# EAGLE design Tutorial1 (EAGLE 7.3.0)
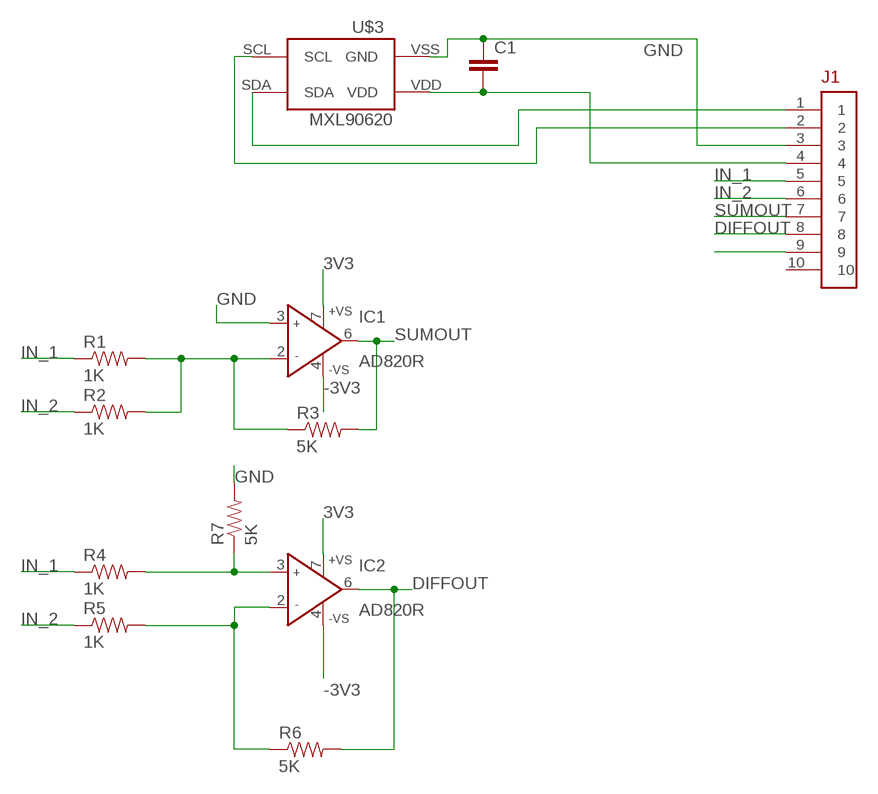
[diagram p0: schematic, sheet 1]

## Parts
C1  CAP0805  [0805]
IC1  AD820R  [SO8]
IC2  AD820R  [SO8]
J1  M50-3120545  [10PINFEMALE]
R1  1K  RESISTOR  [0805]
R2  1K  RESISTOR  [0805]
R3  5K  RESISTOR  [0805]
R4  1K  RESISTOR  [0805]
R5  1K  RESISTOR  [0805]
R6  5K  RESISTOR  [0805]
R7  5K  RESISTOR  [0805]
U$3  MXL90620  [MXL90620]

## Nets
3V3: C1.2 IC1.7(+VS) IC2.7(+VS) J1.4 U$3.VDD
-3V3: IC1.4(-VS) IC2.4(-VS) J1.9
DIFFOUT: IC2.6(OUT) J1.8 R6.2
GND: C1.1 IC1.3(IN+) J1.3 R7.2 U$3.VSS(GND)
IN_1: J1.5 R1.1 R4.1
IN_2: J1.6 R2.1 R5.1
N$1: IC1.2(IN-) R1.2 R2.2 R3.1
N$3: J1.1 U$3.SDA
N$4: J1.2 U$3.SCL
N$5: IC2.2(IN-) R5.2 R6.1
N$6: IC2.3(IN+) R4.2 R7.1
SUMOUT: IC1.6(OUT) J1.7 R3.2
Unconnected: J1.10

## Library data of the parts
C1 = CNTRL_BOARD:CAP: Capacitor Standard 0603 ceramic capacitor, and 0.1" leaded capacitor.
IC1 IC2 = analog-devices:AD820: Single-Supply, Rail-to-Rail, Low Power, FET Input Op Amp Source: http://www.analog.com/static/imported-files/data_sheets/AD820.pdf; OC_FARNELL: 1838867; OC_NEWARK: unknown
J1 = LED_Driver_Board:M50-3120545
R1-R7 = CNTRL_BOARD:RESISTOR
U$3 = CNTRL_BOARD:MXL90620

## Board
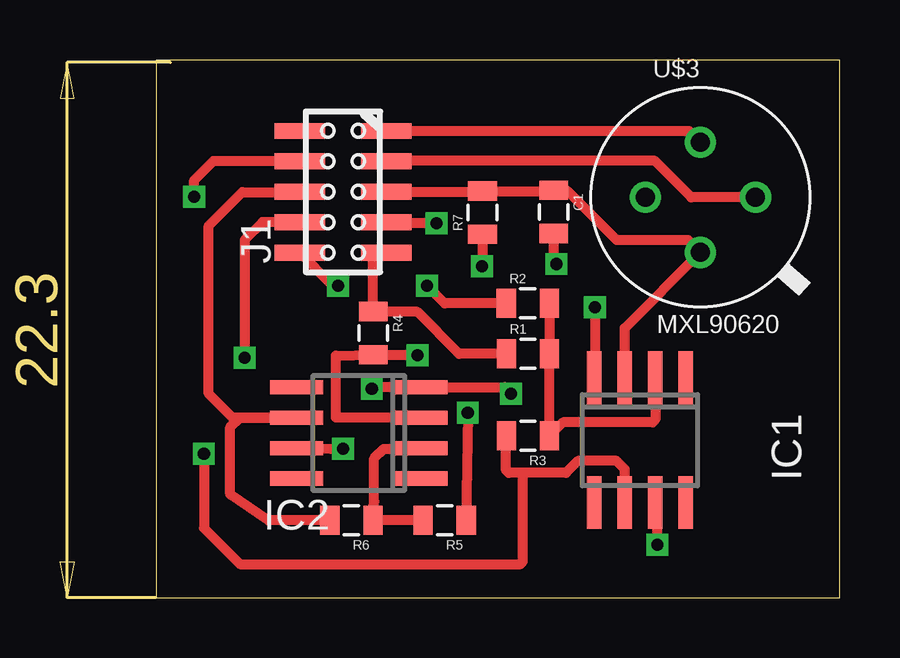
[diagram p1: board, top side]
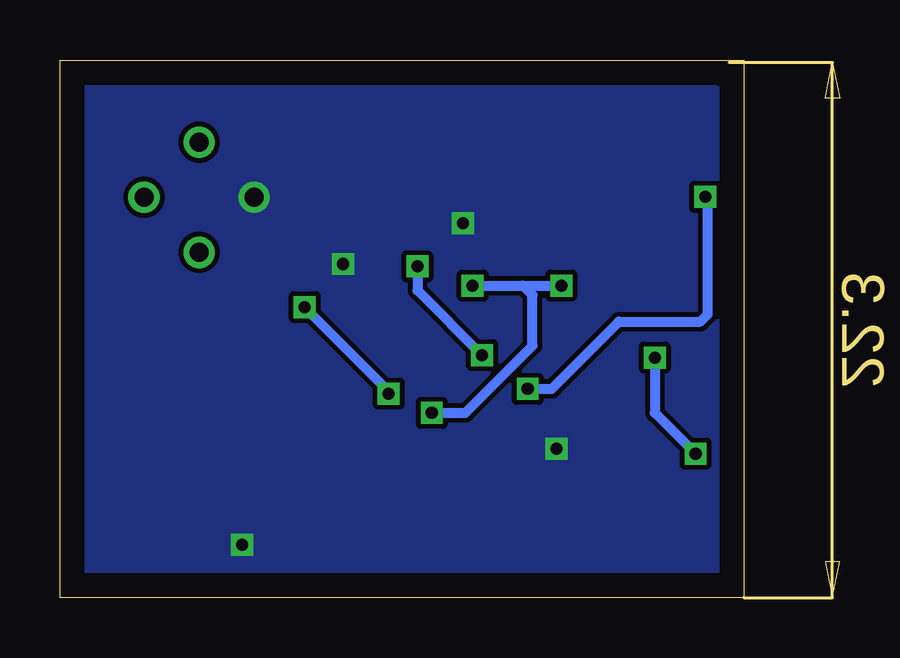
[diagram p2: board, bottom side, seen from below]

Size 28.5 x 22.4 mm. Coordinates in mm from the lower left corner, seen from the top.
Outline: 0,0 28.5,0 28.5,22.4 0,22.4 0,0
Copper layers (1*16): Top 0.035mm / dielectric 1.5mm / Bottom 0.035mm
Design rules "default": minimum track width 10mil, minimum drill 24mil, track to track 8mil, track to pad 8mil, pad to pad 8mil, via to via 8mil, smd to smd 8mil, copper to edge 40mil, drill to drill 8mil, minimum pad ring 10mil, minimum via ring 8mil, stop-mask expansion 4mil, vias tented up to drill 0mil, thermal gap 10mil

### Footprints (pad centres in the part's own frame; a part is rotated, then mirrored left to right if it is on the bottom)
0805 = smd 0.8 x 1.2: 1 -0.9,0; 2 0.9,0
SO8 = smd 0.6 x 2.2: 1 -1.905,-2.6; 2 -0.635,-2.6; 3 0.635,-2.6; 4 1.905,-2.6; 5 1.905,2.6; 6 0.635,2.6; 7 -0.635,2.6; 8 -1.905,2.6
10PINFEMALE = smd 0.65 x 2.1: 1 -2.54,1.8; 2 -1.27,1.8; 3 0,1.8; 4 1.27,1.8; 5 2.54,1.8; 6 2.54,-1.8; 7 1.27,-1.8; 8 0,-1.8; 9 -1.27,-1.8; 10 -2.54,-1.8
MXL90620 = drill 0.8: SCL 2.293,0; VDD -2.293,0; VSS 0,-2.294 | drill 0.8 pad 1.2: SDA 0,2.294

### Placement (x,y rotation side)
C1  16.58,16.07 270 top
IC1  20.18,6.56 180 top
IC2  8.46,6.86 90 top
J1  7.8,16.91 270 top
R1  15.51,10.16 0 top
R2  15.5,12.26 0 top
R3  15.51,6.74 180 top
R4  9.06,11.02 270 top
R5  12.04,3.22 180 top
R6  8.15,3.22 180 top
R7  13.62,16.04 90 top
U$3  22.7,16.68 0 top

### Tracks (layer width: path | path; a pad name or v marks a point on that pad's centre or on a via)
3V3  (via drill 0.51)
  Top 0.406: v7.8,6.2 7.3,6.18 IC2.7 | v20.9,2.2 20.9,3.88 IC1.7 | C1.2 16.58,14.02 v16.7,13.9 | v11.7,15.6 9.64,15.6 J1.4
  pour Bottom (no thermals): -1,23.1 -1,-1 29.7,-0.6 29.2,23.4
-3V3  (via drill 0.51)
  Top 0.406: v14.8,8.5 14.54,8.77 IC2.4 9.06,8.77 v9,8.7 | v18.3,12.1 18.3,9.19 IC1.4 | v1.6,16.7 1.6,17.4 2.4,18.2 5.98,18.2 J1.9
  Bottom 0.406: v14.8,8.5 14.8,8.6 v18.3,12.1 | v9,8.7 8,8.7 5.2,11.5 1.8,11.5 1.5,11.8 1.5,16.6 v1.6,16.7
DIFFOUT
  Top 0.406: R6.2 4.68,3.22 3.1,4.3 3.1,7.1 3.5,7.5 | 3.5,7.5 3.6,7.5 | 3.6,7.5 IC2.6 3.6,7.5 | 3.5,7.5 3.2,7.5 2.2,8.5 2.2,15.5 3.6,16.9 J1.8
GND
  Top 0.406: J1.3 13.59,16.91 R7.2 16.55,16.94 C1.1 17.13,16.97 19.2,14.9 22.19,14.9 U$3.VSS 19.55,11.23 IC1.3
IN_1
  Top 0.406: J1.5 9.57,14.4 9,14.4 9.06,14.34 R4.1 9.08,11.9 10.9,11.9 12.64,10.16 R1.1
IN_2  (via drill 0.51)
  Top 0.406: R2.1 12.04,12.26 v11.3,13 | v7.6,13 7.37,13 J1.6 | R5.1 13.04,7.66 v13,7.7
  Bottom 0.406: v11.3,13 9.2,13 | 9.2,13 v7.6,13 | v13,7.7 11.6,7.7 8.8,10.5 8.8,12.6 9.2,13
N$1
  Top 0.406: R2.2 R1.2 R3.1 16.97,7.3 20.7,7.3 20.82,7.42 IC1.2
N$3
  Top 0.406: J1.1 22.22,19.45 U$3.SDA
N$4
  Top 0.406: U$3.SCL 22.32,16.68 20.8,18.2 9.62,18.2 J1.2
N$5
  Top 0.406: IC2.2 11.04,6.2 9.5,6.2 9.1,5.8 9.1,4 9.05,3.55 R6.1 R5.2
N$6  (via drill 0.51)
  Top 0.406: IC2.3 9.21,7.5 7.5,7.5 7.5,10.08 R4.2 9.08,10.1 v10.9,10.1 | R7.1 13.62,13.82 v13.6,13.8
  Bottom 0.406: v13.6,13.8 13.6,12.8 v10.9,10.1
SUMOUT  (via drill 0.51)
  Top 0.406: IC1.6 19.55,5.36 19.2,5.7 17.6,5.7 17.1,5.2 15.4,5.2 | 15.4,5.2 14.7,5.2 14.6,5.3 R3.2 | J1.7 4.44,15.64 3.7,14.9 v3.7,10 | v2,6 2,2.9 3.5,1.4 15.2,1.4 15.3,1.5 15.3,5.1 15.4,5.2
  Bottom 0.406: v3.7,10 3.7,7.7 v2,6

### Text on the board
Document: EAGLE Tutorial Board V1.0